# Altium schematic sheet RS232.SchDoc
size A; SheetNumber: 9; SheetTotal: 13
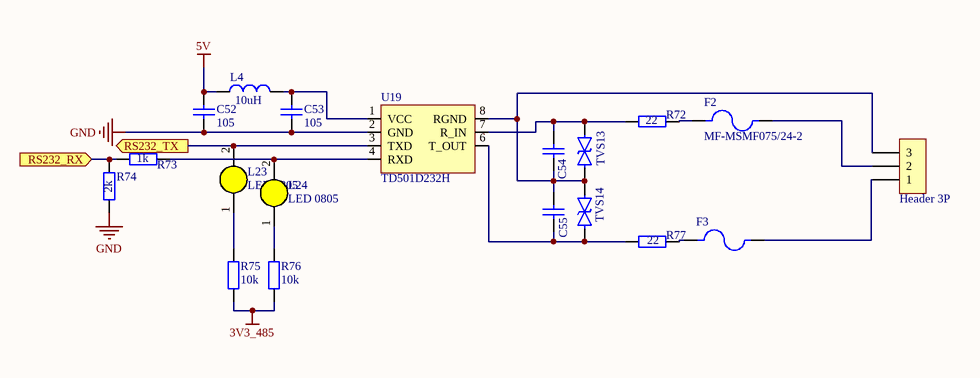
[diagram p0: RS232.SchDoc]

## Parts
C52  105  [0603_Cap]
C53  105  [0603_Cap]
C54  101  [0603_Cap]  (value not drawn)
C55  101  [0603_Cap]  (value not drawn)
F2  MF-MSMF075/24-2  [FUSER_MF-MSMF075/24-2]
F3  MF-MSMF075/24-2  [FUSER_MF-MSMF075/24-2]  (value not drawn)
H23  Header 3P  [CON 3 EDG5.08-3P]
L4  10uH  [0603_Inductor]
L23  LED 0805  [LED-0805-Yellow]
L24  LED 0805  [LED-0805-Yellow]
R72  22  [0603_Res]
R73  1k  [0603_Res]
R74  2k  [0603_Res]
R75  10k  [0603_Res]
R76  10k  [0603_Res]
R77  22  [0603_Res]
TVS13  SMBJ12CA  [SMB - DO-214AA]  (value not drawn)
TVS14  SMBJ12CA  [SMB - DO-214AA]  (value not drawn)
U19  TD501D232H  [TD501D232H]

## Ports
RS232_RX (in), RS232_TX (out)

## Nets
3V3_485: R75.2 R76.2
5V: C52.1 L4.1
GND: C52.2 C53.2 R74.1 U19.2(GND)
RS232_RX: R73.1 R74.2 ; port RS232_RX
RS232_TX: L23.2(K) U19.3(TXD) ; port RS232_TX
NetC53_1: C53.1 L4.2 U19.1(VCC)
NetC54_1: C54.1 R72.2 TVS13.2 U19.7(R_IN)
NetC54_2: C54.2 C55.1 H23.3 TVS13.1 TVS14.2 U19.8(RGND)
NetC55_2: C55.2 R77.2 TVS14.1 U19.6(T_OUT)
NetF2_1: F2.1 R72.1
NetF2_2: F2.2 H23.2
NetF3_1: F3.1 R77.1
NetF3_2: F3.2 H23.1
NetL23_1: L23.1(A) R75.1
NetL24_1: L24.1(A) R76.1
NetL24_2: L24.2(K) R73.2 U19.4(RXD)

## Library data of the parts
C52-C55 = Ceramic Capacitor: Chung_Loai: Dán; Don_Vi: Con; So_Chan: 2; Ten_Linh_Kien: Tụ 0805 104-100nF 10% 50V; Ma_Hang: MH004551; Kieu_Chan: *
F2 F3 = MF-MSMF075/24-2: Polymeric PTC Resettable Fuse 24V 750 mA Ih Surface Mount 1812 (4532 Metric), Concave; MF: Bourns; Value: *; Check_prices: https://www.snapeda.com/parts/MF-MSMF075/24-2/Bourns/view-part/?ref=eda; Availability: In Stock; Price: None; MP: MF-MSMF075/24-2; Package: 1812 Bourns; SnapEDA_Link: https://www.snapeda.com/parts/MF-MSMF075/24-2/Bourns/view-part/?ref=snap; Purchase-URL: https://pricing.snapeda.com/search/part/MF-MSMF075/24-2/?ref=eda
H23 = Header 3P: THT; Ten_Linh_Kien: Header 3P XH2.54-3P Đực Cong; Don_Vi: Con; Ma_Hang: MH001302; Chung_Loai: Cắm
L4 = Inductor: Inductors from EPCOS include SMT Inductors, SMT Power Inductors, Transponder Coils, ISDN Transformers, xDSL Transformers, DC/DC Converters, RF Transformers and SMT Current Sense Transformers.; MP: B82477G4472M000; Price: None; SnapEDA_Link: https://www.snapeda.com/parts/B82477G4472M000/EPCOS/view-part/?ref=snap; Package: NON STANDARD-2 EPCOS; Value: *; Check_prices: https://www.snapeda.com/parts/B82477G4472M000/EPCOS/view-part/?ref=eda; Availability: In Stock; MF: EPCOS; Purchase-URL: https://pricing.snapeda.com/search/part/B82477G4472M000/?ref=eda
L23 L24 = LED 0805 Vang: Dán; Don_Vi: Con; Ma_Hang: MH002329; Ten_Linh_Kien: LED 0805 Màu Vàng ( Yellow); Ghi_Chu: *; Kieu_Chan: *; Chung_Loai: Dán
R72-R77 = Resistor: Chung_Loai: Dán; Don_Vi: Con; So_Chan: 2; Ten_Linh_Kien: Trở 0805 1% 1k; Ma_Hang: MH005468; Kieu_Chan: *
TVS13 TVS14 = TVS Bi Diode